# EAGLE design OvenController (EAGLE 9.3.2)
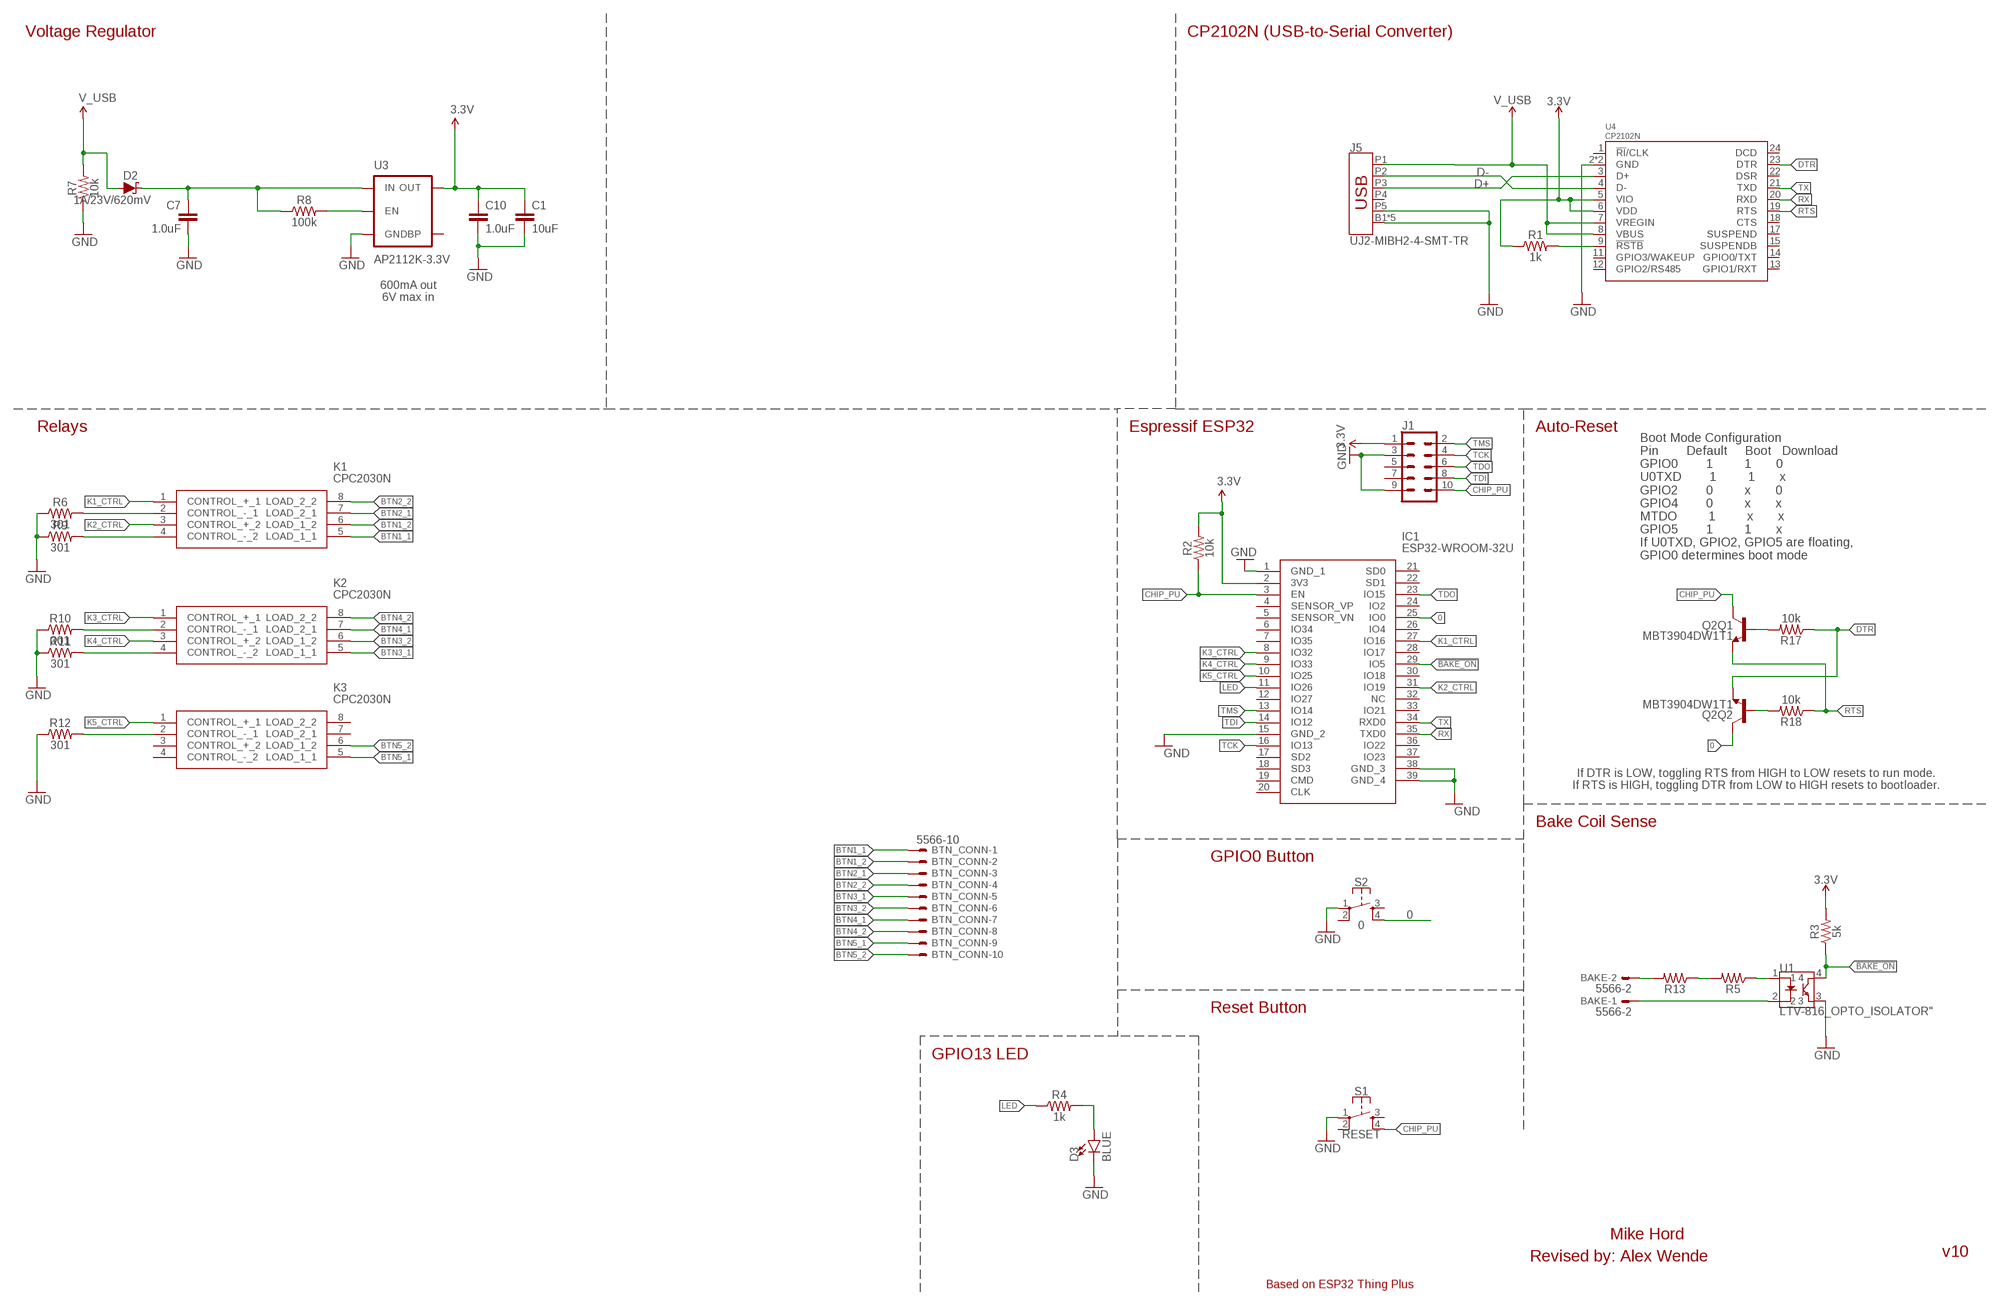
[diagram p0: schematic, sheet 1]

## Parts
BAKE  5566-2  [5566-2]
BTN_CONN  5566-10  [5566-10]
C1  10uF  10UF-0603-6.3V-20%  [0603]
C7  1.0uF  1.0UF-0603-16V-10%-X7R  [0603]
C10  1.0uF  1.0UF-0603-16V-10%-X7R  [0603]
D2  1A/23V/620mV  DIODE-SCHOTTKY-BAT20J  [SOD-323]
D3  BLUE  LED-BLUE0603  [LED-0603]
IC1  ESP32-WROOM-32U  [ESP32WROOM32D]
J1  CONN_05X2PTH  [2X5]
J5  UJ2-MIBH2-4-SMT-TR  [UJ2-MIBH2-4-SMT-TR]
K1  CPC2030N  [SOP254P610X218-8N]
K2  CPC2030N  [SOP254P610X218-8N]
K3  CPC2030N  [SOP254P610X218-8N]
Q2  MBT3904DW1T1  TRANS_NPN_DUAL-MBT3904DW1T1  [SC70-6]
R1  1k  1KOHM-0603-1/10W-1%  [0603]
R2  10k  10KOHM-0603-1/10W-1%  [0603]
R3  5k  RESISTOR0603  [0603]
R4  1k  1KOHM-0603-1/10W-1%  [0603]
R5  300  R-US_R1210W  [R1210W]
R6  301  RESISTOR0603  [0603]
R7  10k  10KOHM-0603-1/10W-1%  [0603]
R8  100k  100KOHM-0603-1/10W-1%  [0603]
R9  301  RESISTOR0603  [0603]
R10  301  RESISTOR0603  [0603]
R11  301  RESISTOR0603  [0603]
R12  301  RESISTOR0603  [0603]
R13  300  R-US_R1210W  [R1210W]
R17  10k  10KOHM-0603-1/10W-1%  [0603]
R18  10k  10KOHM-0603-1/10W-1%  [0603]
S1  RESET  MOMENTARY-SWITCH-SPST-2-SMD-4.6X2.8MM  [TACTILE_SWITCH_SMD_4.6X2.8MM]
S2  0  MOMENTARY-SWITCH-SPST-2-SMD-4.6X2.8MM  [TACTILE_SWITCH_SMD_4.6X2.8MM]
U1  LTV-816_OPTO_ISOLATOR"  [LTV-816_4PIN_DIP]
U3  AP2112K-3.3V  V_REG_LDOSMD  [SOT23-5]
U4  CP2102N  [QFN24]

## Nets
0: IC1.25(IO0) Q2.6(Q2:C) S2.4
3.3V: C1.1 C10.1 IC1.2(3V3) J1.1 R1.1 R2.2 R3.2 U3.5(OUT) U4.5(VIO) U4.6(VDD)
!BAKE_ON: IC1.29(IO5) R3.1 U1.4
BTN1_1: BTN_CONN.1 K1.5(LOAD_1_1)
BTN1_2: BTN_CONN.2 K1.6(LOAD_1_2)
BTN2_1: BTN_CONN.3 K1.7(LOAD_2_1)
BTN2_2: BTN_CONN.4 K1.8(LOAD_2_2)
BTN3_1: BTN_CONN.5 K2.5(LOAD_1_1)
BTN3_2: BTN_CONN.6 K2.6(LOAD_1_2)
BTN4_1: BTN_CONN.7 K2.7(LOAD_2_1)
BTN4_2: BTN_CONN.8 K2.8(LOAD_2_2)
BTN5_1: BTN_CONN.9 K3.5(LOAD_1_1)
BTN5_2: BTN_CONN.10 K3.6(LOAD_1_2)
CHIP_PU: IC1.3(EN) J1.10 Q2.3(Q1:C) R2.1 S1.4
D+: J5.P3(D+) U4.3(D+)
D-: J5.P2(D-) U4.4(D-)
DTR: Q2.1(Q2:E) R17.1 U4.23(DTR)
EN: R8.2 U3.3(EN)
GND: C1.2 C7.2 C10.2 D3.C IC1.1(GND_1) IC1.15(GND_2) IC1.38(GND_3) IC1.39(GND_4) J1.3 J1.9 J5.B1(SHIELD) J5.B2(SHIELD) J5.B3(SHIELD) J5.B4(SHIELD) J5.B5(SHIELD) J5.P5(GND) R6.1 R7.1 R9.1 R10.1 R11.1 R12.1 S1.1 S2.1 U1.3 U3.2(GND) U4.2(GND) U4.PAD(GND)
K1_CTRL: IC1.27(IO16) K1.1(CONTROL_+_1)
K2_CTRL: IC1.31(IO19) K1.3(CONTROL_+_2)
K3_CTRL: IC1.8(IO32) K2.1(CONTROL_+_1)
K4_CTRL: IC1.9(IO33) K2.3(CONTROL_+_2)
K5_CTRL: IC1.10(IO25) K3.1(CONTROL_+_1)
LED: IC1.11(IO26) R4.1
N$1: R1.2 U4.9(!RSTB)
N$2: D3.A R4.2
N$3: C7.1 D2.C R8.1 U3.1(IN)
N$4: BAKE.2 R13.2
N$5: R5.2 R13.1
N$6: BAKE.1 U1.2
N$7: R5.1 U1.1
N$8: K1.2(CONTROL_-_1) R6.2
N$9: K1.4(CONTROL_-_2) R9.2
N$10: Q2.5(Q1:B) R17.2
N$11: K2.2(CONTROL_-_1) R10.2
N$12: Q2.2(Q2:B) R18.2
N$13: K2.4(CONTROL_-_2) R11.2
N$14: K3.2(CONTROL_-_1) R12.2
RTS: Q2.4(Q1:E) R18.1 U4.19(RTS)
RX: IC1.35(TXD0) U4.20(RXD)
TCK: IC1.16(IO13) J1.4
TDI: IC1.14(IO12) J1.8
TDO: IC1.23(IO15) J1.6
TMS: IC1.13(IO14) J1.2
TX: IC1.34(RXD0) U4.21(TXD)
V_USB: D2.A J5.P1(VBUS) R7.2 U4.7(VREGIN) U4.8(VBUS)
Unconnected: IC1.4(SENSOR_VP) IC1.5(SENSOR_VN) IC1.6(IO34) IC1.7(IO35) IC1.12(IO27) IC1.17(SD2) IC1.18(SD3) IC1.19(CMD) IC1.20(CLK) IC1.21(SD0) IC1.22(SD1) IC1.24(IO2) IC1.26(IO4) IC1.28(IO17) IC1.30(IO18) IC1.32(NC) IC1.33(IO21) IC1.36(IO22) IC1.37(IO23) J1.5 J1.7 J5.P4(ID) K3.7(LOAD_2_1) K3.8(LOAD_2_2) S1.2 S1.3 S2.2 S2.3 U3.4(BP) U4.1(!RI!/CLK) U4.11(GPIO3/WAKEUP) U4.12(GPIO2/RS485) U4.13(GPIO1/RXT) U4.14(GPIO0/TXT) U4.15(SUSPENDB) U4.17(SUSPEND) U4.18(CTS) U4.22(DSR) U4.24(DCD)

## Notes on the sheet
- Voltage Regulator | CP2102N (USB-to-Serial Converter)
- 600mA out
  6V max in
- Relays | Espressif ESP32 | Auto-Reset
- Boot Mode Configuration
  Pin        Default     Boot   Download
  GPIO0        1         1       0
  U0TXD        1         1       x
  GPIO2        0         x       0
  GPIO4        0         x       x
  MTDO         1         x       x
  GPIO5        1         1       x
  If U0TXD, GPIO2, GPIO5 are floating, 
  GPIO0 determines boot mode
- If DTR is LOW, toggling RTS from HIGH to LOW resets to run mode.
  If RTS is HIGH, toggling DTR from LOW to HIGH resets to bootloader.
- Bake Coil Sense
- GPIO0 Button
- Reset Button
- GPIO13 LED
- Mike Hord
- v10
- Revised by: Alex Wende
- Based on ESP32 Thing Plus

## Power pins joined to a net without a drawn wire
CONTROL_+_2: K3.3(CONTROL_+_2)
CONTROL_-_2: K3.4(CONTROL_-_2)

## Library data of the parts
BAKE = con-molex:5566-2: Mini FIT connector 2 pol Source: http://www.molex.com; MF: MOLEX; OC_FARNELL: 1822072; OC_NEWARK: unknown
BTN_CONN = con-molex:5566-10: Mini FIT connector 10 pol Source: http://www.molex.com; MF: MOLEX; OC_FARNELL: unknown; OC_NEWARK: unknown
C1 = SparkFun-Capacitors:10UF: 10.0µF ceramic capacitors A capacitor is a passive two-terminal electrical component used to store electrical energy temporarily in an electric field.; PROD_ID: CAP-11015
C7 C10 = SparkFun-Capacitors:1.0UF: 1µF ceramic capacitors A capacitor is a passive two-terminal electrical component used to store electrical energy temporarily in an electric field.; PROD_ID: CAP-13930
D2 = SparkFun-DiscreteSemi:DIODE-SCHOTTKY: Schottky diode A Schottky diode is a semiconductor diode which has a low forward voltage drop and a very fast switching action.; PROD_ID: DIO-11623
D3 = SparkFun-LED:LED-BLUE: Blue SMD LED Used in manufacturing of various products at SparkFun Packages: 0603 - SMD 0603 package [Product Link] <http://www.digikey.com/product-detail/en/SMLE12BC7TT86/511-1589-2-ND/1641808> 1206 - SMD1206 package [Product Link] <http://www.digikey.com/product-detail/en/lite-on-inc/LTST-C150TBKT/160-1643-1-ND/573584> SparkFun Products: ESP8266 Thing-Dev Board <https://www.sparkfun.com/products/13711> RedBoard <https://www.sparkfun.com/products/12757>; PROD_ID: DIO-08575
IC1 = SamacSysImported:ESP32-WROOM-32U: WiFi Modules (802.11) SMD Module, ESP32-D0WD, 32Mbits SPI flash, UART mode, U.FL antenna connector Source: Datasheet <https://www.mouser.de/datasheet/2/891/esp32-wroom-32d_esp32-wroom-32u_datasheet_en-1365844.pdf>; DESCRIPTION: WiFi Modules (802.11) SMD Module, ESP32-D0WD, 32Mbits SPI flash, UART mode, U.FL antenna connector; HEIGHT: 3.1mm; MANUFACTURER_NAME: Espressif; MANUFACTURER_PART_NUMBER: ESP32-WROOM-32U; MOUSER_PART_NUMBER: 356-ESP32-WROOM-32U
J1 = SparkFun-Connectors:CONN_05X2: Multi connection point. Often used as Generic Header-pin footprint for 0.1 inch spaced/style header connections For AVR SPI programming port, see special device with nice symbol: "AVR_SPI_PROG_5x2.dev" You can populate with any combo of single row headers, but if you'd like an exact match, check these: 2x5 AVR ICSP Male Header <https://www.sparkfun.com/products/778> (PRT-00778) 2x5 Pin Shrouded Header <https://www.sparkfun.com/products/8506> (PRT-08506) On any of the 0.1 inch spaced packages, you can populate with these: Break Away Headers - Straight <https://www.sparkfun.com/products/116> (PRT-00116) Break Away Male Headers - Right Angle <https://www.sparkfun.com/products/553> (PRT-00553) Female Headers <https://www.sparkfun.com/products/115> (PRT-00115) Break Away Headers - Machine Pin <https://www.sparkfun.com/products/117> (PRT-00117) Break Away Female Headers - Swiss Machine Pin <https://www.sparkfun.com/products/743> (PRT-00743) Special note: the shrouded connector mates well with our 5x2 ribbon cables: 2x5 Pin IDC Ribbon Cable <https://www.sparkfun.com/products/8535> (PRT-08535); PROD_ID: CONN-08499; SF_ID: PRT-0778
J5 = tew-connectors:UJ2-MIBH2-4-SMT-TR: USB Connectors USB 2.0 micro B jack 5 pin Horizontal SMT Datasheet: https://www.mouser.com/datasheet/2/670/uj2-mibh2-4-smt-1313423.pdf; MFR: CUI; PART_NO: UJ2-MIBH2-4-SMT-TR
K1-K3 = SamacSysImported:CPC2030N: MOSFET Output Optocouplers Dual SP Open Relay 8-Pin SOIC OptoMOS Source: Datasheet <https://componentsearchengine.com/Datasheets/1/CPC2030N.pdf>; DESCRIPTION: MOSFET Output Optocouplers Dual SP Open Relay 8-Pin SOIC OptoMOS; HEIGHT: 2.184mm; MANUFACTURER_NAME: IXYS SEMICONDUCTOR; MANUFACTURER_PART_NUMBER: CPC2030N; MOUSER_PART_NUMBER: 849-CPC2030N; MOUSER_PRICE-STOCK: https://www.mouser.com/Search/Refine.aspx?Keyword=849-CPC2030N
Q2 = SparkFun-DiscreteSemi:TRANS_NPN_DUAL: Dual NPN Transistors in Single Package The MBT3904W1 puts two general purpose 3904 NPN transistors in a single package. Datasheet <http://www.onsemi.com/pub_link/Collateral/MBT3904DW1T1-D.PDF> SparkFun Products: SparkFun ESP32 Thing <https://www.sparkfun.com/products/13907>; PROD_ID: TRANS-13337
R1 R4 = SparkFun-Resistors:1KOHM: 1kΩ resistor A resistor is a passive two-terminal electrical component that implements electrical resistance as a circuit element. Resistors act to reduce current flow, and, at the same time, act to lower voltage levels within circuits. - Wikipedia; PROD_ID: RES-07856
R2 R7 R17 R18 = SparkFun-Resistors:10KOHM: 10kΩ resistor A resistor is a passive two-terminal electrical component that implements electrical resistance as a circuit element. Resistors act to reduce current flow, and, at the same time, act to lower voltage levels within circuits. - Wikipedia; PROD_ID: RES-00824
R3 R6 R9-R12 = SparkFun-Resistors:RESISTOR: Generic Resistor Package
R5 R13 = rcl:R-US_: RESISTOR, American symbol; SPICEPREFIX: R
R8 = SparkFun-Resistors:100KOHM: 100kΩ resistor A resistor is a passive two-terminal electrical component that implements electrical resistance as a circuit element. Resistors act to reduce current flow, and, at the same time, act to lower voltage levels within circuits. - Wikipedia; PROD_ID: RES-07828
S1 S2 = SparkFun-Switches:MOMENTARY-SWITCH-SPST-2: Momentary Switch (Pushbutton) - SPST - Two Circuits Normally-open (NO) SPST momentary switches (buttons, pushbuttons). Schematic symbol includes two switch circuits. Variants SMD-4.6MMX2.8MM - 4.60mm x 2.80mm Tactile Momentary Button Switch - Used on SparkFun SAMD21 Mini Breakout <https://www.sparkfun.com/products/13664> SMD-5.2MM - Mini Pushbutton Switch - SMD <https://www.sparkfun.com/products/8720> - Used on Arduino Pro Mini <https://www.sparkfun.com/products/11114>; PROD_ID: SWCH-13065
U1 = SparkFun-DiscreteSemi:LTV-816_OPTO_ISOLATOR; PROD_ID: IC-14145
U3 = SparkFun-PowerIC:V_REG_LDO: Voltage Regulator LDO Standard 150mA LDO voltage regulator in SOT-23 layout. Micrel part MIC5205. BP (by-pass) pin is used to lower output noise with 470pF cap.; PROD_ID: VREG-12457
U4 = SparkFun-IC-Comms:CP2102N; PROD_ID: IC-14020

## Board
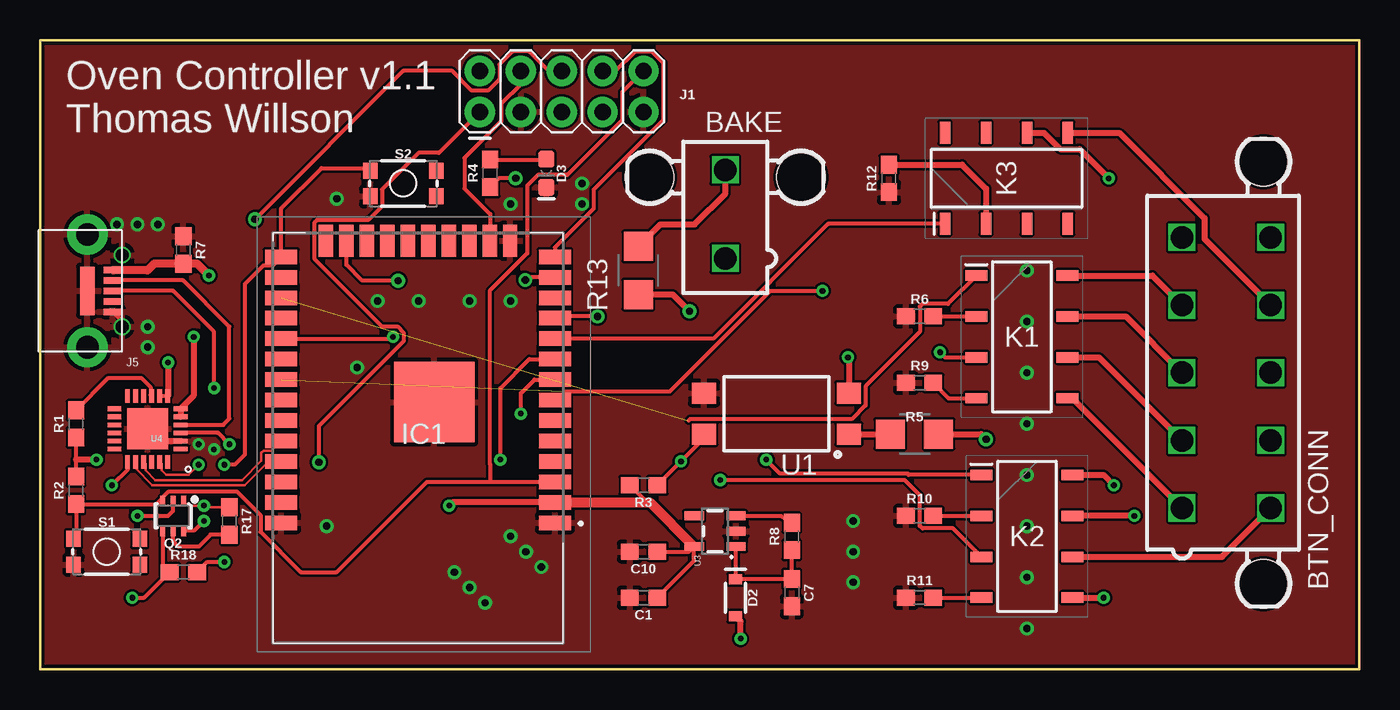
[diagram p1: board, top side]
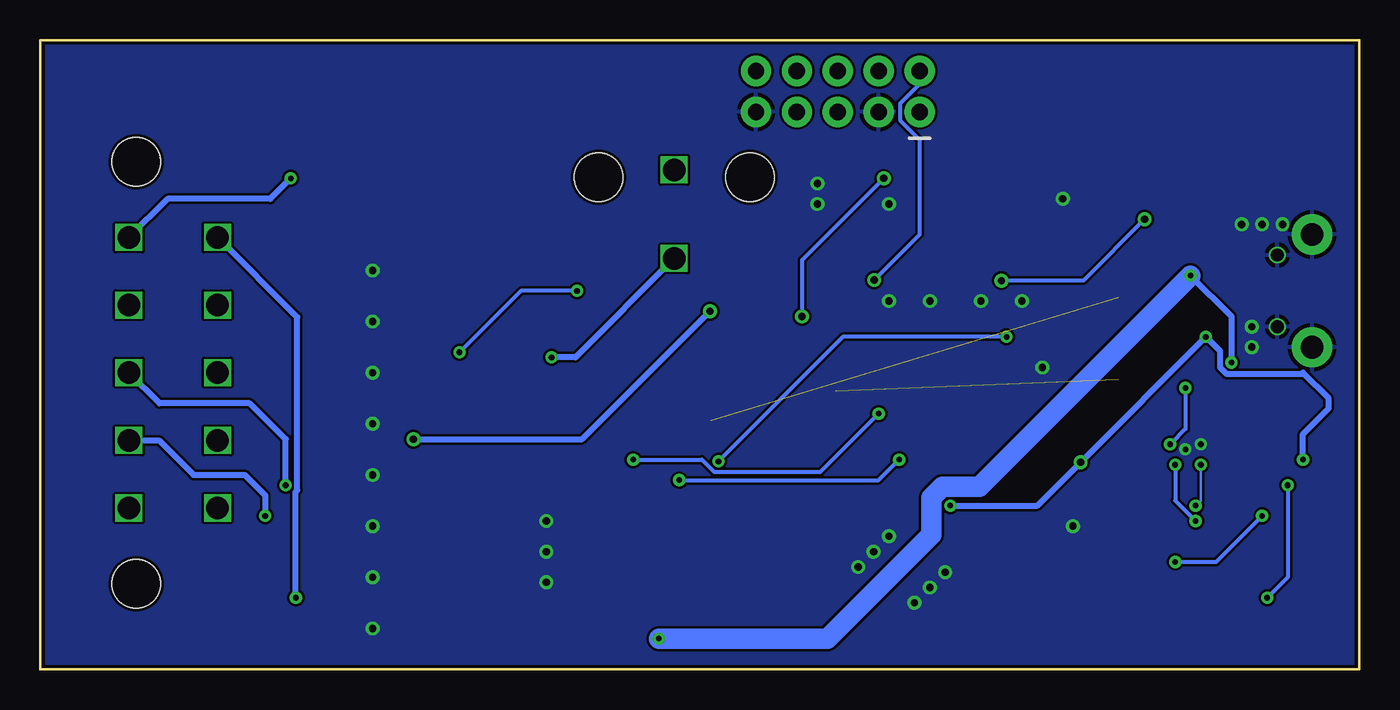
[diagram p2: board, bottom side, seen from below]

Size 81.92 x 39.05 mm. Coordinates in mm from the lower left corner, seen from the top.
Outline: 0,0 0.32,0
Outline: 0,0 0,39.05 81.92,39.05 81.92,0 0,0
Copper layers (1*16): Top 0.035mm / dielectric 1.5mm / Bottom 0.035mm
Design rules "jlcpcb *": minimum track width 5mil, minimum drill 0.3mm, track to track 6mil, track to pad 6mil, pad to pad 6mil, via to via 6mil, smd to smd 6mil, copper to edge 8mil, drill to drill 6mil, minimum pad ring 3mil, minimum via ring 8mil, stop-mask expansion 4mil, vias tented up to drill 0mil, thermal gap 10mil

### Footprints (pad centres in the part's own frame; a part is rotated, then mirrored left to right if it is on the bottom)
5566-2 = drill 1.4 square: 1 0,-2.75; 2 0,2.75 | hole 3: 4.7,2.29; -4.7,2.29
5566-10 = drill 1.4 square: 1 8.4,-2.75; 2 4.2,-2.75; 3 0,-2.75; 4 -4.2,-2.75; 5 -8.4,-2.75; 6 8.4,2.75; 7 4.2,2.75; 8 0,2.75; 9 -4.2,2.75; 10 -8.4,2.75 | hole 3: 13.1,2.29; -13.1,2.29
0603 = smd 1.1 x 1: 1 -0.85,0; 2 0.85,0
SOD-323 = smd 0.63 x 0.83: A 1.15,0; C -1.15,0
LED-0603 = smd 1 x 1: A -0.877,0; C 0.877,0
ESP32WROOM32D = smd 2 x 0.9: 1 -8.15,5.51; 2 -8.15,4.24; 3 -8.15,2.97; 4 -8.15,1.7; 5 -8.15,0.43; 6 -8.15,-0.84; 7 -8.15,-2.11; 8 -8.15,-3.38; 9 -8.15,-4.65; 10 -8.15,-5.92; 11 -8.15,-7.19; 12 -8.15,-8.46; 13 -8.15,-9.73; 14 -8.15,-11; 25 8.85,-11; 26 8.85,-9.73; 27 8.85,-8.46; 28 8.85,-7.19; 29 8.85,-5.92; 30 8.85,-4.65; 31 8.85,-3.38; 32 8.85,-2.11; 33 8.85,-0.84; 34 8.85,0.43; 35 8.85,1.7; 36 8.85,2.97; 37 8.85,4.24; 38 8.85,5.51 | smd 0.9 x 2: 15 -5.365,-12; 16 -4.095,-12; 17 -2.825,-12; 18 -1.555,-12; 19 -0.285,-12; 20 0.985,-12; 21 2.255,-12; 22 3.525,-12; 23 4.795,-12; 24 6.065,-12 | smd 5 x 5: 39 -0.65,-1.99
2X5 = drill 1.016 pad 1.88: 1 0,0; 2 0,2.54; 3 2.54,0; 4 2.54,2.54; 5 5.08,0; 6 5.08,2.54; 7 7.62,0; 8 7.62,2.54; 9 10.16,0; 10 10.16,2.54
UJ2-MIBH2-4-SMT-TR = smd 0.9 x 3: B1 -2.15,0 | drill 1.4 pad 2.5: B2 -2.15,3.5; B3 -2.15,-3.5 | drill 0.8 pad 1.05: B4 0,2.225; B5 0,-2.225 | smd 1.15 x 0.4: P1 -0.575,1.3; P2 -0.575,0.65; P3 -0.575,0; P4 -0.575,-0.65; P5 -0.575,-1.3
SOP254P610X218-8N = smd 1.35 x 0.65: 1 -2.825,3.81; 2 -2.825,1.27; 3 -2.825,-1.27; 4 -2.825,-3.81; 5 2.825,-3.81; 6 2.825,-1.27; 7 2.825,1.27; 8 2.825,3.81
SC70-6 = smd 0.3 x 0.66: 1 -0.65,-0.92; 2 0,-0.92; 3 0.65,-0.92; 4 0.65,0.92; 5 0,0.92; 6 -0.65,0.92
R1210W = smd 1.8 x 1.8: 1 -1.499,0; 2 1.499,0
TACTILE_SWITCH_SMD_4.6X2.8MM = smd 0.9 x 1: 1 -2.05,-0.8; 2 2.05,-0.8; 3 2.05,0.8; 4 -2.05,0.8
LTV-816_4PIN_DIP = smd 1.5 x 1.3: 1 -4.5,1.27; 2 -4.5,-1.27; 3 4.5,-1.27; 4 4.5,1.27
SOT23-5 = smd 0.55 x 1.2: 1 -0.95,-1.3; 2 0,-1.3; 3 0.95,-1.3; 4 0.95,1.3; 5 -0.95,1.3
QFN24 = smd 0.85 x 0.3: 1 -2.05,1.25; 2 -2.05,0.75; 3 -2.05,0.25; 4 -2.05,-0.25; 5 -2.05,-0.75; 6 -2.05,-1.25; 13 2.05,-1.25; 14 2.05,-0.75; 15 2.05,-0.25; 16 2.05,0.25; 17 2.05,0.75; 18 2.05,1.25 | smd 0.3 x 0.85: 7 -1.25,-2.05; 8 -0.75,-2.05; 9 -0.25,-2.05; 10 0.25,-2.05; 11 0.75,-2.05; 12 1.25,-2.05; 19 1.25,2.05; 20 0.75,2.05; 21 0.25,2.05; 22 -0.25,2.05; 23 -0.75,2.05; 24 -1.25,2.05 | smd 2.55 x 2.55: PAD 0,0

### Placement (x,y rotation side)
BAKE  42.55,28.26 0 top
BTN_CONN  73.66,18.41 270 top
C1  37.47,4.45 180 top
C7  46.67,4.76 270 top
C10  37.47,7.3 180 top
D2  43.18,4.45 270 top
D3  31.43,30.8 270 top
IC1  23.81,14.61 180 top
J1  27.3,34.61 0 top
J5  5.08,23.5 0 top
K1  60.96,20.64 0 top
K2  61.28,8.26 0 top
K3  60.01,30.48 90 top
Q2  8.26,9.53 180 top
R1  2.22,15.24 90 top
R2  2.22,11.11 90 top
R3  37.47,11.43 180 top
R4  27.94,30.8 90 top
R5  54.29,14.61 0 top
R6  54.61,21.91 0 top
R7  8.89,26.04 270 top
R8  46.67,8.26 90 top
R9  54.61,17.78 0 top
R10  54.61,9.53 0 top
R11  54.61,4.45 0 top
R12  52.7,30.48 90 top
R13  37.15,24.77 90 top
R17  11.75,9.21 270 top
R18  8.89,6.03 0 top
S1  4.13,7.3 0 top
S2  22.54,30.16 0 top
U1  45.72,15.88 180 top
U3  41.91,8.57 90 top
U4  6.67,14.92 180 top

### Tracks (layer width: path | path; a pad name or v marks a point on that pad's centre or on a via)
0  (via drill 0.35)
  Top 0.254: v11.43,12.7 12.06,12.7 12.7,13.34 12.7,23.92 13.85,25.06 14.42,25.06 IC1.25 14.96,28.61 17.46,31.11 20.34,31.11 S2.4 | v10.16,9.21 9.56,8.61 Q2.6
  Bottom 0.254: v11.43,12.7 11.43,10.48 v10.16,9.21
3.3V  (via drill 0.35, 0.45)
  Top 0.254: R2.2 2.22,13.02 R1.1 | C10.1 40.29,7.3 U3.5 | R3.2 40.42,7.62 U3.5 | C1.1 40.61,6.74 U3.5 | J1.1 24.77,32.07 23.5,32.07 21.22,29.79 21.22,28.75 20.36,27.88 17.18,27.88 17.02,27.72 17.02,25.49 21.21,21.3 22.18,21.3 22.57,20.91 22.57,20.36 17.3,15.1 v17.3,12.86
  Top 0.381: IC1.2 25.61,10.37 v25.4,10.16 | v9.53,20.64 9.53,16.98 U4.6 U4.5 | v3.49,13.02 2.22,13.02
  Top 0.635: IC1.2 37.87,10.37 U3.5
  Bottom 0.381: v25.4,10.16 20,10.16 v17.3,12.86 v9.53,20.64 8.66,19.77 8.66,18.75 8.24,18.33 3.58,18.33 3.49,18.41 1.91,16.83 1.91,16.19 3.49,14.61 v3.49,13.02
!BAKE_ON  (via drill 0.35)
  Top 0.254: R3.1 v39.8,12.91 41.22,14.34 U1.4 | IC1.29 21.91,20.52 v21.91,20.64
  Bottom 0.254: v21.91,20.64 32.07,20.64 v39.8,12.91
BTN1_1
  Top 0.381: K1.5 64.1,16.83 BTN_CONN.1
BTN1_2
  Top 0.381: K1.6 65.76,19.37 BTN_CONN.2
BTN2_1
  Top 0.381: K1.7 67.42,21.91 BTN_CONN.3
BTN2_2
  Top 0.381: K1.8 69.08,24.45 BTN_CONN.4
BTN3_1  (via drill 0.35)
  Top 0.381: K2.5 v66.04,4.45
  Bottom 0.381: v66.04,4.45 66.04,11.04 65.95,11.13 65.95,21.86 BTN_CONN.5
BTN3_2
  Top 0.381: K2.6 73.38,6.99 BTN_CONN.6
BTN4_1  (via drill 0.35)
  Top 0.381: v67.94,9.53 K2.7
  Bottom 0.381: BTN_CONN.7 74.54,14.21 72.39,12.06 69.22,12.06 67.94,10.79 v67.94,9.53
BTN4_2  (via drill 0.35)
  Top 0.381: K2.8 66.04,12.06 v66.67,11.43
  Bottom 0.381: v66.67,11.43 66.67,14.29 68.9,16.51 74.5,16.51 BTN_CONN.8
BTN5_1
  Top 0.381: BTN_CONN.9 72.3,26.72 72.3,28.01 67,33.3 K3.5
BTN5_2  (via drill 0.35)
  Top 0.381: K3.6 62.33,33.3 63.35,32.29 64.55,32.29 v66.36,30.48
  Bottom 0.381: v66.36,30.48 67.63,29.21 74.02,29.21 BTN_CONN.10
CHIP_PU
  Top 0.254: R2.1 2.22,8.25 S1.4 | R2.1 7.42,10.26 Q2.3 | R2.1 7.2,10.26 7.99,11.05 12.2,11.05 13.68,9.57 13.68,8.53 16.18,6.03 18.41,6.03 24.02,11.63 27.94,11.63 | 27.94,11.63 IC1.3 | 27.94,11.63 27.94,12.72 27.92,12.74 27.92,23.5 30.23,25.82 30.23,30.03 30.91,30.7 32.74,30.7 36.14,34.1 36.14,35.83 J1.10
D+  (via drill 0.35)
  Top 0.254: v10.79,17.46 10.79,20.95 8.26,23.5 J5.P3 | U4.3 11.04,14.67 v11.75,13.97
  Bottom 0.254: v10.79,17.46 10.79,14.92 v11.75,13.97
D-
  Top 0.254: U4.4 11.36,15.17 11.75,15.56 11.75,21.27 8.88,24.14 J5.P2
DTR  (via drill 0.35)
  Top 0.152: U4.23 7.54,12.75 7.54,12.35 7.83,12.06 9.21,12.06 v9.84,12.7 | R17.1 10.26,10.06 v10.16,10.16 9.19,10.16 Q2.1
  Bottom 0.152: v9.84,12.7 9.84,10.48 v10.16,10.16
EN
  Top 0.254: U3.3 45.4,9.52 45.4,9.53 45.98,9.53 R8.2
GND  (via drill 0.35, 0.45)
  Top 0.254: J5.P5 5.08,21.62 J5.B5
  Top 0.381: U4.2 7.42,14.17 U4.PAD
  other vias: 9.84,13.97 10.79,13.65 4.76,27.62 6.03,27.62 7.3,27.62 33.66,30.16 33.66,28.89 25.72,6.03 26.67,5.08 27.62,4.13 29.21,8.26 30.16,7.3 31.11,6.35 20.95,22.86 23.5,22.86 26.67,22.86 29.21,22.86 50.48,9.21 50.48,7.3 50.48,5.4 6.67,21.27 6.67,20 19.68,18.73 17.78,8.89 61.28,2.54 61.28,5.71 61.28,8.89 61.28,12.06 61.28,15.24 61.28,18.41 61.28,21.59 61.28,24.77 18.41,29.21 29.21,28.89
  pour Top: 0,39.05 81.92,39.05 81.92,0.32 0,0.32
  pour Bottom: 0,39.05 81.92,39.05 81.92,0 0,0
K1_CTRL  (1 unrouted)
  Top 0.254: 40.27,15.45 40.35,15.53 50.41,15.53 51.25,16.38 51.25,17.56 54.63,20.94 54.63,22.52 54.79,22.69 56.37,22.69 K1.1
K2_CTRL  (via drill 0.35)  (1 unrouted)
  Top 0.254: v48.58,23.5 45.34,23.5 39.1,17.26 32.5,17.26 | v55.88,19.68 56.2,19.37 K1.3
  Bottom 0.254: v48.58,23.5 52.07,23.5 v55.88,19.68
K3_CTRL  (via drill 0.35)
  Top 0.254: K2.1 53.95,12.06 53.86,12.15 45.95,12.15 v45.09,13.02 | v29.84,15.88 29.84,17.14 30.68,17.98 IC1.8
  Bottom 0.254: v45.09,13.02 40.83,13.02 40.07,12.25 33.47,12.25 v29.84,15.88
K4_CTRL  (via drill 0.35)
  Top 0.254: v42.23,11.75 53.69,11.75 54.63,10.81 54.63,8.91 54.79,8.75 56.69,8.75 K2.3 | v28.57,13.02 28.57,17.46 30.37,19.25 IC1.9
  Bottom 0.254: v42.23,11.75 29.84,11.75 v28.57,13.02
K5_CTRL
  Top 0.254: K3.1 48.93,27.66 41.8,20.52 IC1.10
LED  (via drill 0.45)
  Top 0.254: v29.53,30.48 28.47,30.48 R4.1 | v34.61,21.91 32.08,21.91 IC1.11
  Bottom 0.254: v29.53,30.48 34.61,25.4 v34.61,21.91
N$1
  Top 0.254: R1.2 4.23,18.1 6.26,18.1 6.85,17.51 6.85,17.04 U4.9
N$2
  Top 0.254: R4.2 31.41,31.65 D3.A
N$3
  Top 0.254: U3.1 43.21,5.62 D2.C 43.2,5.61 C7.1 R8.1
N$4
  Top 0.381: R13.2 38.51,27.62 40.64,27.62 42.55,29.53 BAKE.2
N$5  (via drill 0.45)
  Top 0.381: R5.2 58.42,14.61 v58.74,14.29 | v40.32,22.23 39.28,23.27 R13.1
  Bottom 0.381: v58.74,14.29 48.26,14.29 v40.32,22.23
N$6  (via drill 0.35)
  Top 0.381: v50.16,19.37 50.22,19.31 U1.2
  Bottom 0.381: BAKE.1 48.69,19.37 v50.16,19.37
N$7
  Top 0.381: U1.1 R5.1
N$8
  Top 0.254: R6.2 K1.2
N$9
  Top 0.254: R9.2 56.41,16.83 K1.4
N$10
  Top 0.254: R17.2 10.58,8.36 9.84,7.62 8.57,7.62 8.26,7.94 Q2.5
N$11
  Top 0.254: R10.2 K2.2
N$12  (via drill 0.35)
  Top 0.254: R18.2 10.38,6.67 v11.43,6.67 | v6.03,9.53 7.94,9.53 8.26,9.84 Q2.2
  Bottom 0.254: v11.43,6.67 8.89,6.67 v6.03,9.53
N$13
  Top 0.254: R11.2 K2.4
N$14
  Top 0.381: R12.2 57.25,31.33 58.74,29.84 K3.2
RTS  (via drill 0.35)
  Top 0.254: Q2.4 7.61,6.47 R18.1 6.45,4.45 v5.71,4.45 | U4.19 5.42,12.4 v4.45,11.43
  Bottom 0.254: v4.45,11.43 4.45,5.71 v5.71,4.45
RX
  Top 0.152: U4.20 5.92,12.47 6.96,11.43 12.7,11.43 14.18,12.9 IC1.35
TCK
  Top 0.254: J1.4 29.84,36.33 28.63,35.11 28.63,34.02 26.35,31.75 26.35,29.84 27.94,28.26 27.94,26.64 IC1.16
TDI
  Top 0.254: IC1.14 31.96,26.2 34.36,28.6 34.36,29.78 38.68,34.1 38.68,37.65 37.97,38.37 36.96,38.37 35.74,37.15 J1.8
TDO  (via drill 0.45)
  Top 0.254: v13.34,27.94 22.54,37.15 25.58,37.15 26.8,35.93 27.81,35.93 28.52,36.64 28.52,37.55 29.34,38.37 30.35,38.37 31.57,37.15 J1.6 | v22.23,24.13 20,24.13 19.02,25.11 IC1.23
  Bottom 0.254: v13.34,27.94 17.14,24.13 v22.23,24.13
TMS  (via drill 0.45)
  Top 0.254: IC1.13 30.29,24.34 v30.12,24.17
  Bottom 0.254: v30.12,24.17 27.3,26.99 27.3,32.88 28.52,34.1 28.52,35.11 27.3,36.33 J1.2
TX
  Top 0.152: IC1.34 14.37,13.58 13.87,13.58 13.73,13.45 13.73,12.95 12.54,11.75 7.14,11.75 6.54,12.35 6.54,12.75 U4.21
V_USB  (via drill 0.35)
  Top 0.254: U4.8 U4.7
  Top 0.381: v7.94,19.05 7.94,16.99 U4.7 | v43.5,1.91 43.5,2.98 D2.A
  Top 0.508: v10.48,24.45 9.74,25.18 R7.2 7.09,25.18 6.67,24.77 4.54,24.77 J5.P1
  Bottom 0.381: v10.48,24.45 7.94,21.91 v7.94,19.05
  Bottom 1.27: v43.5,1.91 33.02,1.91 26.57,8.36 26.57,10.64 25.88,11.33 23.6,11.33 v10.48,24.45

### Text on the board
tNames: Oven Controller v1.1 / Thomas Willson